# Altium schematic sheet UART_Ctrl.SchDoc
size A4
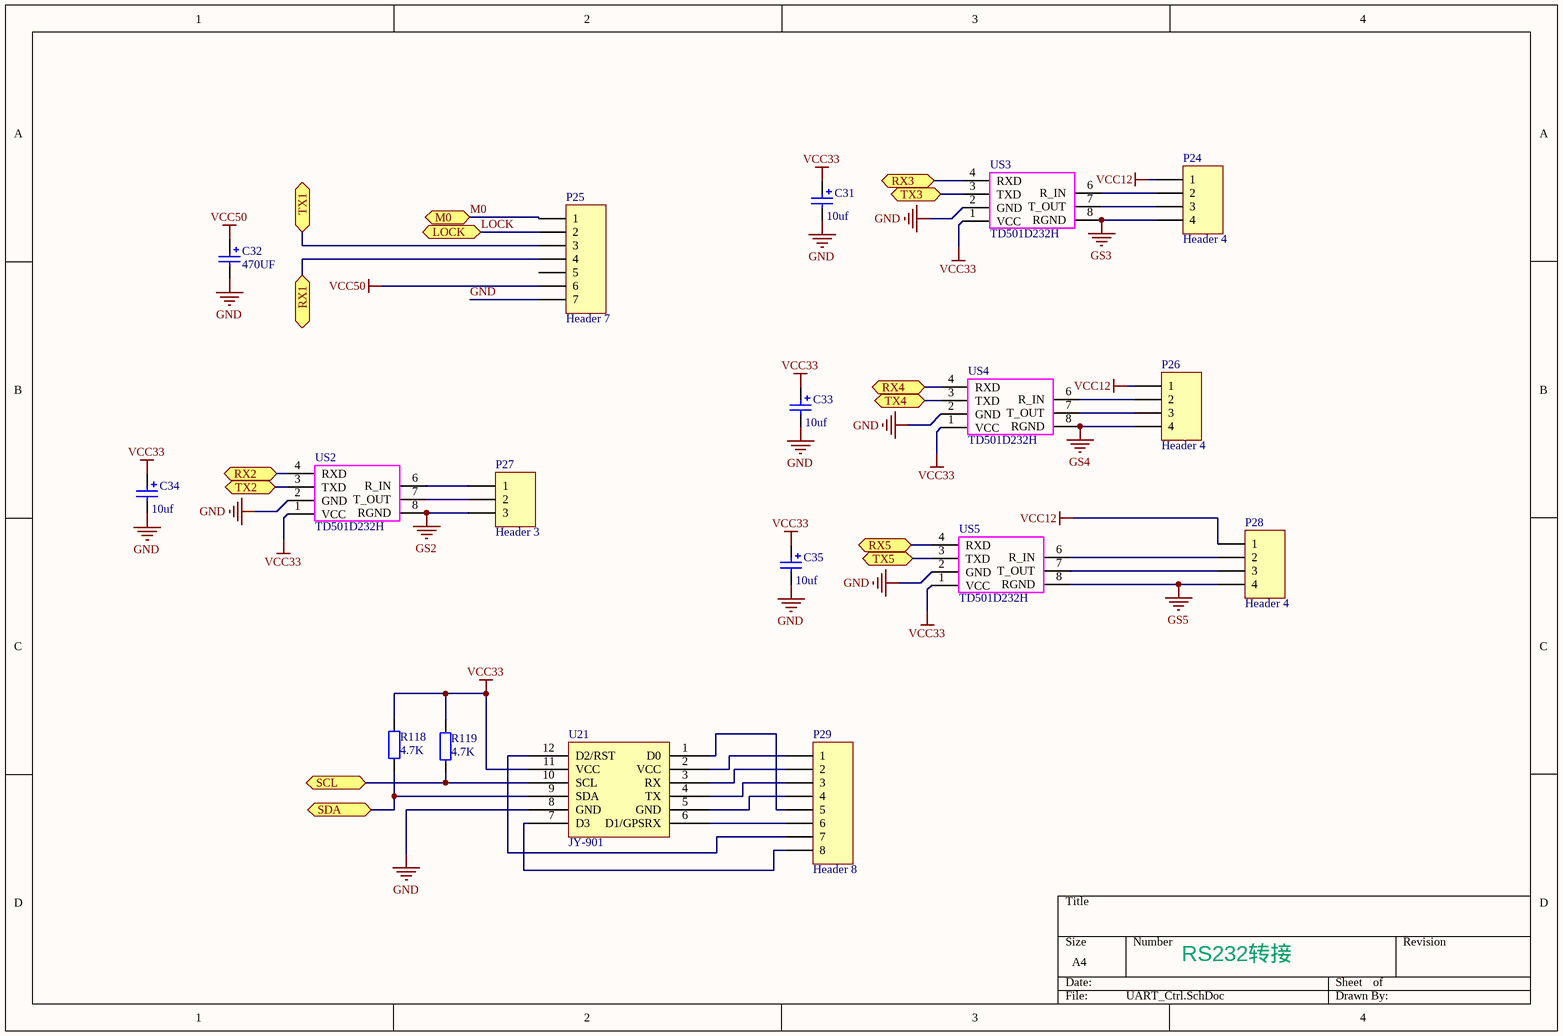
[diagram p0: UART_Ctrl.SchDoc]

## Parts
C31  value 10uf  [C1206]  (hidden comment: Cap Pol2)
C32  value 470UF  [7243-D-TA]  (hidden comment: Cap Pol2)
C33  value 10uf  [C1206]  (hidden comment: Cap Pol2)
C34  value 10uf  [C1206]  (hidden comment: Cap Pol2)
C35  value 10uf  [C1206]  (hidden comment: Cap Pol2)
P24  Header 4  [3.81-4P]
P25  Header 7  [HDR1X7]
P26  Header 4  [3.81-4P]
P27  Header 3  [381-3]
P28  Header 4  [3.81-4P]
P29  Header 8  [HDR1X8]
R118  value 4.7K  [R1206]  (hidden comment: Res2)
R119  value 4.7K  [R1206]  (hidden comment: Res2)
U21  JY-901  [JY-901]
US2  TD501D232H  [TD501D232H]
US3  TD501D232H  [TD501D232H]
US4  TD501D232H  [TD501D232H]
US5  TD501D232H  [TD501D232H]

## Ports
LOCK, M0, RX1, RX2, RX3, RX4, RX5, SCL (bidir), SDA (bidir), TX1, TX2, TX3, TX4, TX5

## Nets
GND: C31.2 C32.2 C33.2 C34.2 C35.2 P25.7 U21.8(GND) US2.2(GND) US3.2(GND) US4.2(GND) US5.2(GND)
GS2: P27.3 US2.8(RGND)
GS3: P24.4 US3.8(RGND)
GS4: P26.4 US4.8(RGND)
GS5: P28.4 US5.8(RGND)
VCC12: P24.1 P26.1 P28.1
VCC33: C31.1 C33.1 C34.1 C35.1 R118.1 R119.1 U21.11(VCC) US2.1(VCC) US3.1(VCC) US4.1(VCC) US5.1(VCC)
VCC50: C32.1 P25.6
LOCK: P25.2 ; port LOCK
M0: P25.1 ; port M0
RX1: P25.4 ; port RX1
RX2: US2.4(RXD) ; port RX2
RX3: US3.4(RXD) ; port RX3
RX4: US4.4(RXD) ; port RX4
RX5: US5.4(RXD) ; port RX5
SCL: R119.2 U21.10(SCL) ; port SCL
SDA: R118.2 U21.9(SDA) ; port SDA
TX1: P25.3 ; port TX1
TX2: US2.3(TXD) ; port TX2
TX3: US3.3(TXD) ; port TX3
TX4: US4.3(TXD) ; port TX4
TX5: US5.3(TXD) ; port TX5
NetP24_2: P24.2 US3.6(R_IN)
NetP24_3: P24.3 US3.7(T_OUT)
NetP26_2: P26.2 US4.6(R_IN)
NetP26_3: P26.3 US4.7(T_OUT)
NetP27_1: P27.1 US2.6(R_IN)
NetP27_2: P27.2 US2.7(T_OUT)
NetP28_2: P28.2 US5.6(R_IN)
NetP28_3: P28.3 US5.7(T_OUT)
NetP29_1: P29.1 U21.2(VCC)
NetP29_2: P29.2 U21.3(RX)
NetP29_3: P29.3 U21.4(TX)
NetP29_4: P29.4 U21.5(GND)
NetP29_5: P29.5 U21.1(D0)
NetP29_6: P29.6 U21.6(D1/GPSRX)
NetP29_7: P29.7 U21.12(D2/RST)
NetP29_8: P29.8 U21.7(D3)

Not connected (* = marked no-connect by the designer): P25 5

## Notes on the sheet
- RS232转接

## Library data of the parts
C31-C35 = Cap Pol2: Polarized Capacitor (Axial); Published: 8-Jun-2000; LatestRevisionDate: 17-Jul-2002; LatestRevisionNote: Re-released for DXP Platform.; PackageReference: POLAR0.8; Publisher: Altium Limited
P24 P26 P28 = Header 4: Header, 4-Pin; LatestRevisionDate: 17-Jul-2002; LatestRevisionNote: Re-released for DXP Platform.; Publisher: Altium Limited
P25 = Header 7: Header, 7-Pin; LatestRevisionDate: 17-Jul-2002; LatestRevisionNote: Re-released for DXP Platform.; Publisher: Altium Limited
P27 = Header 3: Header, 3-Pin; LatestRevisionDate: 17-Jul-2002; LatestRevisionNote: Re-released for DXP Platform.; Publisher: Altium Limited
P29 = Header 8: Header, 8-Pin; LatestRevisionDate: 17-Jul-2002; LatestRevisionNote: Re-released for DXP Platform.; Publisher: Altium Limited
R118 R119 = Res2: Resistor; Published: 8-Jun-2000; LatestRevisionDate: 17-Jul-2002; LatestRevisionNote: Re-released for DXP Platform.; PackageReference: AXIAL-0.4; Publisher: Altium Limited
U21 = JY-901: 君悦智控高精度9轴传感器